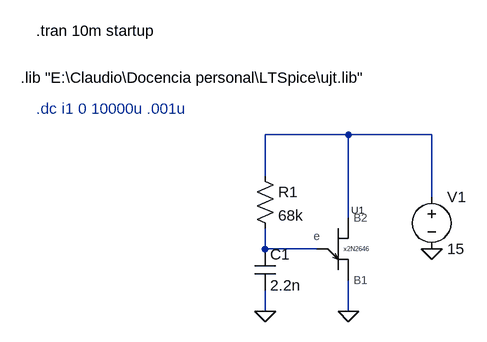
[diagram p0: schematic ujt2.asc]
ujt2.asc, the LTspice schematic file:
Version 4
SHEET 1 1588 1236
WIRE 640 64 512 64
WIRE 768 64 640 64
WIRE 512 128 512 64
WIRE 768 160 768 64
WIRE 640 192 640 64
WIRE 512 240 512 208
WIRE 592 240 512 240
WIRE 512 336 512 304
WIRE 640 336 640 288
FLAG 768 240 0
FLAG 512 336 0
FLAG 640 336 0
SYMBOL voltage 768 144 R0
WINDOW 123 0 0 Left 0
WINDOW 39 0 0 Left 0
SYMATTR InstName V1
SYMATTR Value 15
SYMBOL nujt 624 240 R0
SYMATTR Value x2N2646
SYMATTR InstName U1
SYMBOL cap 496 240 R0
SYMATTR InstName C1
SYMATTR Value 2.2n
SYMBOL res 496 112 R0
SYMATTR InstName R1
SYMATTR Value 68k
TEXT 136 -24 Left 2 !.lib "E:\\Claudio\\Docencia personal\\LTSpice\\ujt.lib"
TEXT 160 24 Left 2 ;.dc i1 0 10000u .001u
TEXT 160 -96 Left 2 !.tran 10m startup

The netlist it stands for:
* ujt2.asc
V1 N001 0 15
XU1 N002 0 N001 x2N2646  ; pins e B1 B2
C1 N002 0 2.2n
R1 N001 N002 68k
.lib "E:\Claudio\Docencia personal\LTSpice\ujt.lib"
* .dc i1 0 10000u .001u
.tran 10m startup
.backanno
.end